# EAGLE design pressure-sensor (EAGLE 6.4)
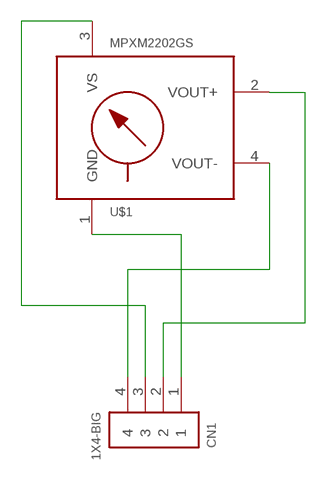
[diagram p0: schematic, sheet 1]

## Parts
CN1  1X4-BIG  [1X04-BIG]
U$1  MPXM2202GS  [1320A]

## Nets
N$1: CN1.1 U$1.1(GND)
N$2: CN1.2 U$1.2(VOUT+)
N$3: CN1.3 U$1.3(VS)
N$4: CN1.4 U$1.4(VOUT-)
Unconnected: U$1.6(NC)

## Library data of the parts
CN1 = adafruit:1X4: 4-pin connector
U$1 = mpx-freescale:MPXM2202GS

## Board
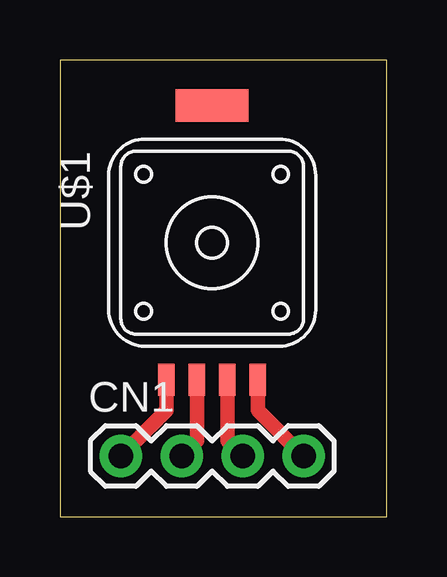
[diagram p1: board, top side]

Size 13.64 x 19.04 mm. Coordinates in mm from the lower left corner, seen from the top.
Outline: 0,0 13.64,0 13.64,19.04 0,19.04 0,0
Copper layers (1*16): Top 0.035mm / dielectric 1.5mm / Bottom 0.035mm
Design rules "default": minimum track width 10mil, minimum drill 24mil, track to track 8mil, track to pad 8mil, pad to pad 8mil, via to via 8mil, smd to smd 8mil, copper to edge 40mil, drill to drill 8mil, minimum pad ring 10mil, minimum via ring 8mil, stop-mask expansion 4mil, vias tented up to drill 0mil, thermal gap 10mil

### Footprints (pad centres in the part's own frame; a part is rotated, then mirrored left to right if it is on the bottom)
1X04-BIG = drill 1.016 pad 1.778: 1 0,0; 2 2.54,0; 3 5.08,0; 4 7.62,0
1320A = smd 1.346 x 0.686: 1 5.715,-1.905; 2 5.715,-0.635; 3 5.715,0.635; 4 5.715,1.905 | smd 1.346 x 3.048: 6 -5.715,0

### Placement (x,y rotation side)
CN1  2.54,2.54 0 top
U$1  6.35,11.43 270 top

### Tracks (layer width: path | path; a pad name or v marks a point on that pad's centre or on a via)
N$1
  Top 0.61: U$1.1 4.45,4.45 CN1.1
N$2
  Top 0.61: U$1.2 5.71,3.17 CN1.2
N$3
  Top 0.61: U$1.3 6.99,3.17 CN1.3
N$4
  Top 0.61: U$1.4 8.26,4.45 CN1.4